# EAGLE design PCB-DISPLAYDOGM1 (EAGLE 7.7.0)

## Sheet 1 of 2
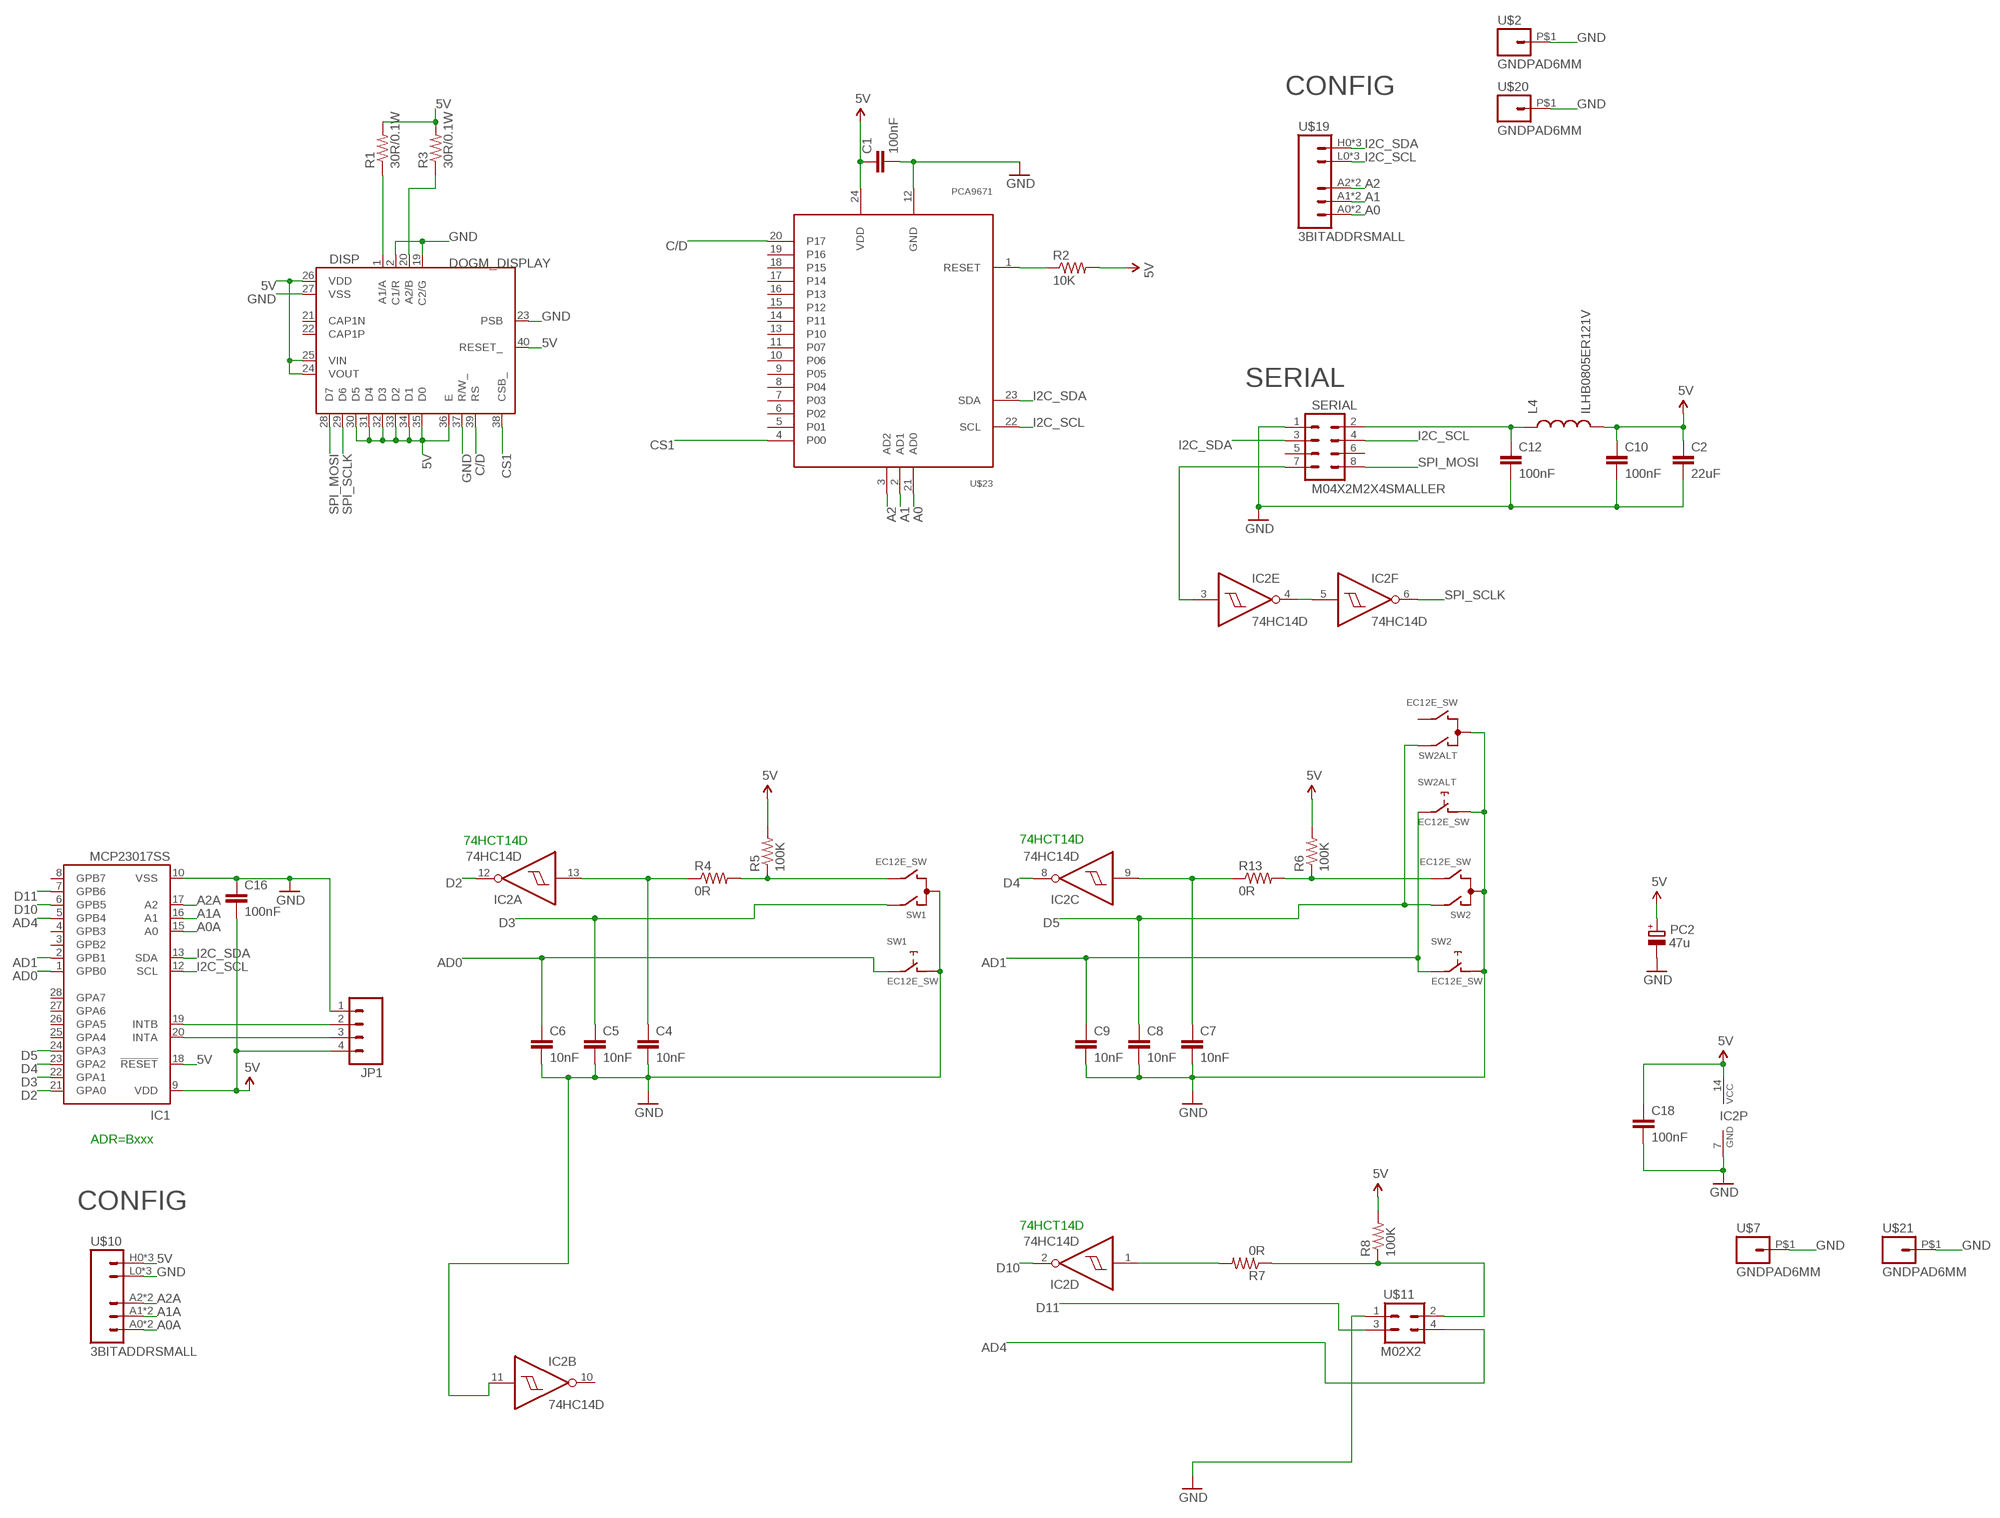
[diagram p0: schematic, sheet 1]

### Parts
C1  100nF  CAP0603-CAP  [0603-CAP]
C2  22uF  CAP0805  [0805]
C4  10nF  CAP0603-CAP  [0603-CAP]
C5  10nF  CAP0603-CAP  [0603-CAP]
C6  10nF  CAP0603-CAP  [0603-CAP]
C7  10nF  CAP0603-CAP  [0603-CAP]
C8  10nF  CAP0603-CAP  [0603-CAP]
C9  10nF  CAP0603-CAP  [0603-CAP]
C10  100nF  CAP0603-CAP  [0603-CAP]
C12  100nF  CAP0603-CAP  [0603-CAP]
C16  100nF  CAP0603-CAP  [0603-CAP]
C18  100nF  CAP0603-CAP  [0603-CAP]
DISP  DOGM_DISPLAY  [DOGM]
IC1  MCP23017SS  [SSOP28]
IC2  74HC14D  [SO14]
JP1  M04PTH  [1X04]
L4  ILHB0805ER121V  INDUCTOR0805  [0805]
PC2  47u  CPOL-EUD  [PANASONIC_D]
R1  30R/0.1W  RESISTOR0603-RES  [0603-RES]
R2  10K  RESISTOR0603-RES  [0603-RES]
R3  30R/0.1W  RESISTOR0603-RES  [0603-RES]
R4  0R  RESISTOR0603-RES  [0603-RES]
R5  100K  RESISTOR0603-RES  [0603-RES]
R6  100K  RESISTOR0603-RES  [0603-RES]
R7  0R  RESISTOR0603-RES  [0603-RES]
R8  100K  RESISTOR0603-RES  [0603-RES]
R13  0R  RESISTOR0603-RES  [0603-RES]
SERIAL  M04X2M2X4SMALLER  [M2X4SMALLER]
SW1  EC12E_SW  [ALPS_EC12E_SW]
SW2  EC12E_SW  [ALPS_EC12E_SW]
SW2ALT  EC12E_SW  [ALPS_EC12E_SW]
U$2  GNDPAD6MM  [3.2MMPAD6MM]
U$7  GNDPAD6MM  [3.2MMPAD6MM]
U$10  3BITADDRSMALL  [3BITADDR_SMALL]
U$11  M02X2  [2X2]
U$19  3BITADDRSMALL  [3BITADDR_SMALL]
U$20  GNDPAD6MM  [3.2MMPAD6MM]
U$21  GNDPAD6MM  [3.2MMPAD6MM]
U$23  PCA9671  [TSSOP24]

### Nets
5V [Power]: C1.1 C2.1 C10.1 C16.2 C18.1 DISP.24(VOUT) DISP.25(VIN) DISP.26(VDD) DISP.30(D5) DISP.31(D4) DISP.32(D3) DISP.33(D2) DISP.34(D1) DISP.35(D0) DISP.36(E) DISP.40(RESET_) IC1.9(VDD) IC1.18(!RESET) IC2.14(P:VCC) JP1.4 L4.2 PC2.+ R1.2 R2.2 R3.2 R5.2 R6.2 R8.2 U$10.H0(VCC) U$10.H1(VCC) U$10.H2(VCC) U$23.24(VDD)
A0: U$19.A0 U$19.AS0(A0) U$23.21(AD0)
A0A: IC1.15(A0) U$10.A0 U$10.AS0(A0)
A1: U$19.A1 U$19.AS1(A1) U$23.2(AD1)
A1A: IC1.16(A1) U$10.A1 U$10.AS1(A1)
A2: U$19.A2 U$19.AS2(A2) U$23.3(AD2)
A2A: IC1.17(A2) U$10.A2 U$10.AS2(A2)
AD0: C6.1 IC1.1(GPB0) SW1.E
AD1: C9.1 IC1.2(GPB1) SW2.E SW2ALT.E
AD4: IC1.5(GPB4) U$11.4
ARD_5V [Power]: C12.1 L4.1 SERIAL.2
C/D: DISP.39(RS) U$23.20(P17)
CS1: DISP.38(CSB_) U$23.4(P00)
D2: IC1.21(GPA0) IC2.12(A:O)
D3: C5.1 IC1.22(GPA1) SW1.A
D4: IC1.23(GPA2) IC2.8(C:O)
D5: C8.1 IC1.24(GPA3) SW2.A SW2ALT.A
D10: IC1.6(GPB5) IC2.2(D:O)
D11: IC1.7(GPB6) U$11.3
GND [Power]: C1.2 C2.2 C4.2 C5.2 C6.2 C7.2 C8.2 C9.2 C10.2 C12.2 C16.1 C18.2 DISP.2(C1/R) DISP.19(C2/G) DISP.23(PSB) DISP.27(VSS) DISP.37(R/W_) IC1.10(VSS) IC2.7(P:GND) IC2.11(B:I) JP1.1 PC2.- SERIAL.1 SW1.C SW1.D SW2.C SW2.D SW2ALT.C SW2ALT.D U$2.P$1 U$7.P$1 U$10.L0(GND) U$10.L1(GND) U$10.L2(GND) U$11.1 U$20.P$1 U$21.P$1 U$23.12(GND)
I2C_SCL: IC1.12(SCL) SERIAL.4 U$19.L0(GND) U$19.L1(GND) U$19.L2(GND) U$23.22(SCL)
I2C_SDA: IC1.13(SDA) SERIAL.3 U$19.H0(VCC) U$19.H1(VCC) U$19.H2(VCC) U$23.23(SDA)
N$1: R2.1 U$23.1(RESET)
N$2: DISP.1(A1/A) R1.1
N$3: DISP.20(A2/B) R3.1
N$4: R4.2 R5.1 SW1.B
N$5: IC2.1(D:I) R7.2
N$6: R6.1 R13.2 SW2.B
N$7: IC2.4(E:O) IC2.5(F:I)
N$8: IC2.3(E:I) SERIAL.7
N$17: IC1.19(INTB) JP1.2
N$18: IC1.20(INTA) JP1.3
N$124: C4.1 IC2.13(A:I) R4.1
N$125: C7.1 IC2.9(C:I) R13.1
N$127: R7.1 R8.1 U$11.2
SPI_MOSI: DISP.28(D7) SERIAL.8
SPI_SCLK: DISP.29(D6) IC2.6(F:O)
Unconnected: DISP.21(CAP1N) DISP.22(CAP1P) IC1.3(GPB2) IC1.4(GPB3) IC1.8(GPB7) IC1.25(GPA4) IC1.26(GPA5) IC1.27(GPA6) IC1.28(GPA7) IC2.10(B:O) SERIAL.5 SERIAL.6 SW1.GND1(G) SW1.GND2(G) SW2.GND1(G) SW2.GND2(G) SW2ALT.B SW2ALT.GND1(G) SW2ALT.GND2(G) U$23.5(P01) U$23.6(P02) U$23.7(P03) U$23.8(P04) U$23.9(P05) U$23.10(P06) U$23.11(P07) U$23.13(P10) U$23.14(P11) U$23.15(P12) U$23.16(P13) U$23.17(P14) U$23.18(P15) U$23.19(P16)

### Notes on the sheet
- CONFIG
- SERIAL
- 74HCT14D | 74HCT14D
- ADR=Bxxx
- CONFIG
- 74HCT14D

## Sheet 2 of 2

## Library data of the parts
C1 C2 C4-C10 C12 C16 C18 = SparkFun:CAP: Capacitor Standard 0603 ceramic capacitor, and 0.1" leaded capacitor.
DISP = SKAARHOJ:DOGM_DISPLAY
IC1 = microchip:MCP23017: http://ww1.microchip.com/downloads/en/DeviceDoc/21952a.pdf Source: http://ww1.microchip.com/downloads/en/DeviceDoc/21952a.pdf; MF: MICROCHIP; MPN: MCP23017-E/SS; OC_FARNELL: 1467674; OC_NEWARK: 31K2960
IC2 = 74xx-eu:74*14: Hex schmitt trigger INVERTER
JP1 = SparkFun:M04: Header 4 Standard 4-pin 0.1" header. Use with straight break away headers (SKU : PRT-00116), right angle break away headers (PRT-00553), swiss pins (PRT-00743), machine pins (PRT-00117), and female headers (PRT-00115). Molex polarized connector foot print use with SKU : PRT-08231 with associated crimp pins and housings. 1MM SMD Version SKU: PRT-10208
L4 = SparkFun:INDUCTOR: Inductors Basic Inductor/Choke - 0603 and 1206. Footprints are not proven and vary greatly between part numbers.
PC2 = rcl:CPOL-EU: POLARIZED CAPACITOR, European symbol
R1-R8 R13 = SparkFun:RESISTOR: Resistor Basic schematic elements and footprints for 0603, 1206, and PTH resistors.
SERIAL = SKAARHOJ:M04X2
SW1 SW2 SW2ALT = switch-alps:EC12E_SW: ALPS rotary Encoder EC12E series with switch; MPN: EC12E2424407; OC_FARNELL: 1520813; OC_NEWARK: 74M1068
U$2 U$7 U$20 U$21 = SKAARHOJ:GNDPAD
U$10 U$19 = SKAARHOJ:3BITADDR
U$11 = SKAARHOJ:M02X2
U$23 = SKAARHOJ:PCA9671

## Net classes
0 default: width 0.203 mm, drill 0.406 mm, clearance 0.203 mm
1 Power: width 0.406 mm, drill 0.61 mm, clearance 0.203 mm
2 BoostPower: width 0.61 mm, drill 0.61 mm, clearance 0.305 mm

## Board
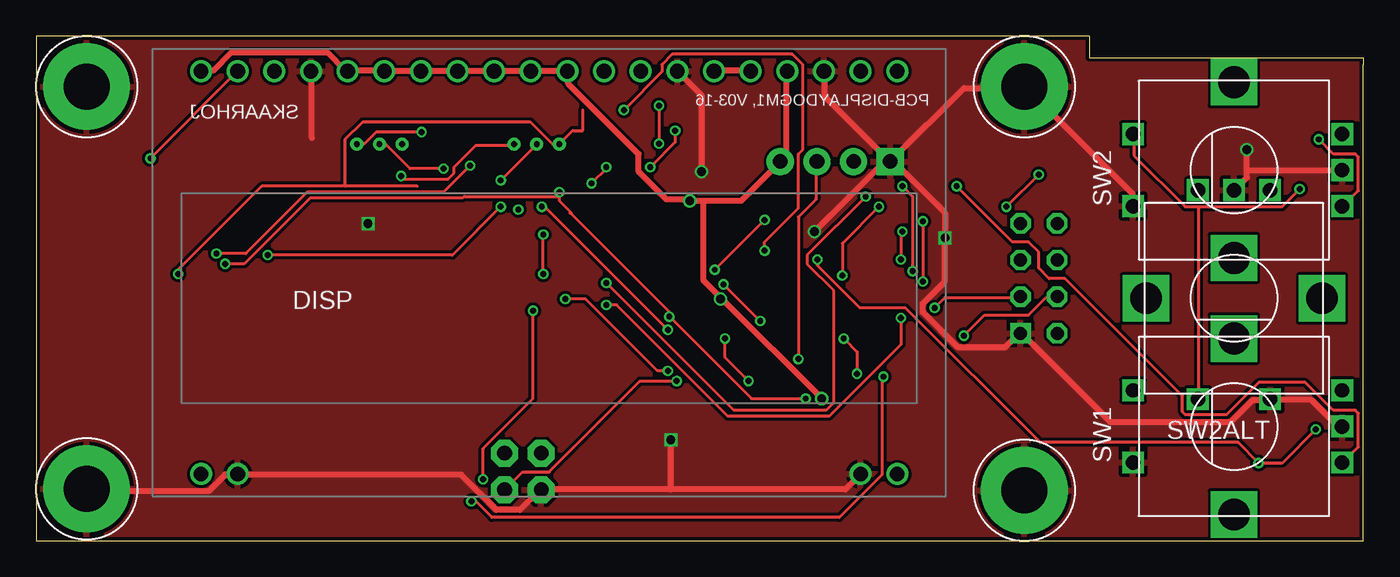
[diagram p1: board, top side]
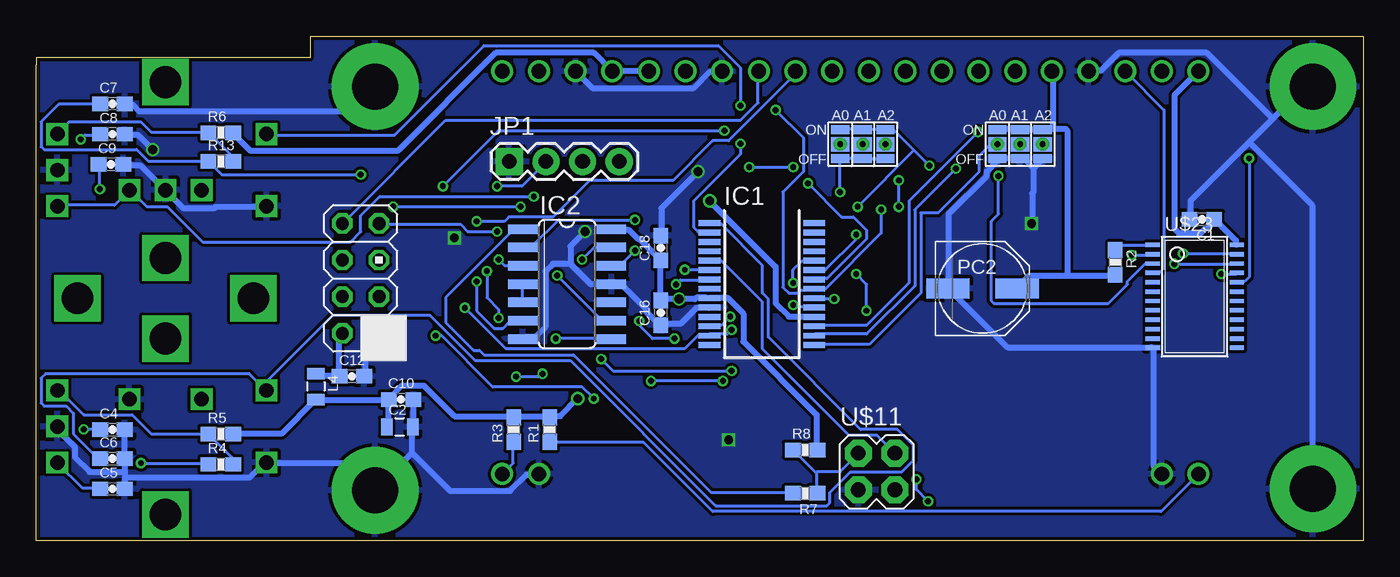
[diagram p2: board, bottom side, seen from below]

Size 92 x 35 mm. Coordinates in mm from the lower left corner, seen from the top.
Outline: 92,0 92,33 92,33.5 73,33.5 73,35 0,35 0,0 92,0
Copper layers (1*16): Top 0.035mm / dielectric 1.5mm / Bottom 0.035mm
Design rules "Fusion_eagle_rule_v1.1": minimum track width 6mil, minimum drill 12mil, track to track 6mil, track to pad 6mil, pad to pad 6mil, via to via 6mil, smd to smd 0mil, copper to edge 10mil, drill to drill 10mil, minimum pad ring 10mil, minimum via ring 6mil, stop-mask expansion 2mil, vias tented up to drill 100mil, thermal gap 10mil

### Footprints (pad centres in the part's own frame; a part is rotated, then mirrored left to right if it is on the bottom)
0603-CAP = smd 1.1 x 1: 1 -0.85,0; 2 0.85,0
0805 = smd 0.8 x 1.2: 1 -0.9,0; 2 0.9,0
DOGM = drill 1.016: 1 -24.13,-12.19; 2 -21.59,-12.19; 19 21.59,-12.19; 20 24.13,-12.19; 21 24.13,15.75; 22 21.59,15.75; 23 19.05,15.75; 24 16.51,15.75; 25 13.97,15.75; 26 11.43,15.75; 27 8.89,15.75; 28 6.35,15.75; 29 3.81,15.75; 30 1.27,15.75; 31 -1.27,15.75; 32 -3.81,15.75; 33 -6.35,15.75; 34 -8.89,15.75; 35 -11.43,15.75; 36 -13.97,15.75; 37 -16.51,15.75; 38 -19.05,15.75; 39 -21.59,15.75; 40 -24.13,15.75
SSOP28 = smd 0.4 x 1.5: 1 -4.225,-3.625; 2 -3.575,-3.625; 3 -2.925,-3.625; 4 -2.275,-3.625; 5 -1.625,-3.625; 6 -0.975,-3.625; 7 -0.325,-3.625; 8 0.325,-3.625; 9 0.975,-3.625; 10 1.625,-3.625; 11 2.275,-3.625; 12 2.925,-3.625; 13 3.575,-3.625; 14 4.225,-3.625; 15 4.225,3.625; 16 3.575,3.625; 17 2.925,3.625; 18 2.275,3.625; 19 1.625,3.625; 20 0.975,3.625; 21 0.325,3.625; 22 -0.325,3.625; 23 -0.975,3.625; 24 -1.625,3.625; 25 -2.275,3.625; 26 -2.925,3.625; 27 -3.575,3.625; 28 -4.225,3.625
SO14 = smd 0.66 x 2.032: 1 -3.81,-3.073; 2 -2.54,-3.073; 3 -1.27,-3.073; 4 0,-3.073; 5 1.27,-3.073; 6 2.54,-3.073; 7 3.81,-3.073; 8 3.81,3.073; 9 2.54,3.073; 10 1.27,3.073; 11 0,3.073; 12 -1.27,3.073; 13 -2.54,3.073; 14 -3.81,3.073
1X04 = drill 1.016 pad 1.88 square: 1 0,0 | drill 1.016 pad 1.88: 2 2.54,0; 3 5.08,0; 4 7.62,0
PANASONIC_D = smd 3 x 1.4: + 2.4,0; - -2.4,0
0603-RES = smd 1.1 x 1: 1 -0.85,0; 2 0.85,0
M2X4SMALLER = drill 0.9 square: 1 -1.27,3.81 | drill 0.9 octagon: 2 1.27,3.81; 3 -1.27,1.27; 4 1.27,1.27; 5 -1.27,-1.27; 6 1.27,-1.27; 7 -1.27,-3.81; 8 1.27,-3.81
ALPS_EC12E_SW = drill 1 square: A -2.5,-7.5; B 2.5,-7.5; C 0,-7.5; D -2.5,7; E 2.5,7 | drill 2.2 square: GND1 -6.1,0; GND2 6.1,0
3.2MMPAD6MM = drill 3.2 pad 6: P$1 0,0
3BITADDR_SMALL = drill 0.4: A0 -1.565,0; A1 0,0; A2 1.565,0 | smd 1.27 x 1: AS0 -1.565,0; AS1 0,0; AS2 1.565,0 | smd 1.27 x 0.635: H0 -1.565,1; H1 0,1; H2 1.565,1; L0 -1.565,-1; L1 0,-1; L2 1.565,-1
2X2 = drill 1.016 pad 1.88 octagon: 1 -3.81,-1.27; 2 -3.81,1.27; 3 -1.27,-1.27; 4 -1.27,1.27
TSSOP24 = smd 0.305 x 0.991: 1 -4.225,-2.918; 2 -3.575,-2.918; 3 -2.925,-2.918; 4 -2.275,-2.918; 5 -1.625,-2.918; 6 -0.975,-2.918; 7 -0.325,-2.918; 8 0.325,-2.918; 9 0.975,-2.918; 10 1.625,-2.918; 11 2.275,-2.918; 12 2.925,-2.918; 13 2.925,2.918; 14 2.275,2.918; 15 1.625,2.918; 16 0.975,2.918; 17 0.325,2.918; 18 -0.325,2.918; 19 -0.975,2.918; 20 -1.625,2.918; 21 -2.275,2.918; 22 -2.925,2.918; 23 -3.575,2.918; 24 -4.225,2.918

### Placement (x,y rotation side)
C1  11.2,22.3 180 bottom
C2  66.8,7.9 0 bottom
C4  86.7,7.7 0 bottom
C5  86.7,3.6 0 bottom
C6  86.7,5.7 0 bottom
C7  86.7,30.3 0 bottom
C8  86.7,28.2 0 bottom
C9  86.8,26.1 0 bottom
C10  66.7,9.8 0 bottom
C12  70.1,11.4 0 bottom
C16  48.7,15.8 90 bottom
C18  48.7,20.3 90 bottom
DISP  35.56,16.81 0 top
IC1  41.7,17.8 270 bottom
IC2  55.2,17.8 270 bottom
JP1  59.2,26.3 0 bottom
L4  72.6,10.7 270 bottom
PC2  26.4,17.5 0 bottom
R1  56.4,7.7 90 bottom
R2  17.2,19.3 270 bottom
R3  58.9,7.7 90 bottom
R4  79.2,5.3 0 bottom
R5  79.2,7.4 0 bottom
R6  79.2,28.3 0 bottom
R7  38.7,3.3 180 bottom
R8  38.7,6.3 0 bottom
R13  79.2,26.3 0 bottom
SERIAL  69.5,18.2 180 bottom
SW1  83.03,7.92 90 top
SW2  83.03,25.7 90 top
SW2ALT  83.03,16.81 180 top
U$2  3.5,31.5 0 top
U$7  68.5,3.5 0 top
U$10  23.8,27.5 0 bottom
U$11  31.2,4.8 0 bottom
U$19  34.7,27.5 0 bottom
U$20  68.5,31.5 0 top
U$21  3.5,3.6 0 top
U$23  11.7,16.3 270 bottom

### Tracks (layer width: path | path; a pad name or v marks a point on that pad's centre or on a via)
5V  (via drill 0.61)
  Top 0.406: DISP.36 21.64,32.61 24.08,32.61 DISP.35 24.28,32.61 26.62,32.61 DISP.34 26.82,32.61 29.16,32.61 DISP.33 29.36,32.61 31.7,32.61 DISP.32 31.9,32.61 34.24,32.61 DISP.31 34.44,32.61 36.78,32.61 DISP.30 36.88,32.41 36.88,31.7 41.76,26.82 41.76,25.6 43.69,23.67 45.21,23.67 v45.31,23.57 46.23,23.57 | 21.64,32.41 DISP.36 | DISP.40 11.48,32.61 12.29,32.61 13.51,33.83 20.22,33.83 21.44,32.61 DISP.36 | DISP.26 47.04,32.61 49.48,32.61 DISP.25 | 46.23,23.57 48.87,23.57 51.51,26.21 JP1.4 51.71,26.42 52.02,26.72 52.02,32.51 DISP.24 | 47.5,16.82 46.23,18.09 46.23,23.57 | 47.5,16.82 v54.46,9.86 | v47.45,16.76 47.5,16.82
  Bottom 0.406: U$23.24 8.84,20.62 8.84,20.83 10.26,22.25 C1.1 10.46,22.15 11.28,21.34 12.8,21.34 13.11,21.64 13.11,30.89 11.48,32.51 DISP.40 | 20.52,18.39 23.16,18.39 23.98,17.58 PC2.+ | 20.52,18.39 17.27,18.39 R2.2 | 20.52,18.39 20.52,28.45 20.62,28.55 21.54,28.55 | R6.2 78.33,28.25 77.11,27.03 66.95,27.03 60.15,33.83 53.34,33.83 52.12,32.61 DISP.24 51.92,32.61 49.58,32.61 DISP.25 | IC2.14 52.12,21.54 50.9,21.54 50.29,20.93 50.19,20.93 48.77,19.51 C18.1 48.77,19.41 48.77,16.66 C16.2 48.56,16.76 v47.45,16.76 46.33,16.76 46.23,16.87 45.52,16.87 IC1.9 45.31,16.87 44.09,16.87 42.98,15.75 42.98,13.82 37.9,8.74 37.9,6.4 R8.2 | C10.1 67.56,9.75 67.56,8.03 67.67,7.92 C2.1 | R5.2 78.33,7.42 74.98,7.42 72.64,9.75 L4.2 72.44,9.75 67.77,9.75 C10.1 | C10.1 67.46,9.96 66.65,10.77 65.13,10.77 62.99,8.64 59.03,8.64 R3.2 58.83,8.64 56.49,8.64 R1.2 56.29,8.64 55.68,8.64 v54.46,9.86 | v45.31,23.57 40.74,19 40.74,16.46 39.83,15.54 38.1,15.54 IC1.18 | U$10.H0 25.3,28.55 23.98,28.55 U$10.H1 23.77,28.55 22.25,28.55 U$10.H2 22.05,28.55 21.54,28.55 | 21.54,28.55 21.54,32.51 DISP.36
A0  (via drill 0.41)
  Top 0.203: v9.86,18.49 9.86,18.8 15.65,24.59 21.44,24.59 | 26.42,24.59 21.44,24.59 | 37.9,29.87 37.9,28.45 37.19,28.45 36.27,27.53 U$19.AS0 36.17,27.53 35.76,27.53 34.24,29.06 22.66,29.06 21.44,27.84 21.44,24.59
  Bottom 0.203: v9.86,18.49 8.84,18.49 U$23.21 | 36.27,27.53 U$19.AS0
A0A
  Bottom 0.203: IC1.15 38,13.61 34.24,13.61 30.68,17.17 30.68,22.76 29.46,22.76 26.62,25.6 26.62,26.72 25.81,27.53 25.5,27.53 U$10.AS0 25.4,27.53
A1  (via drill 0.41)
  Top 0.203: v16.05,19.81 28.85,19.81 v32.21,23.16 | v32.21,24.99 34.65,27.43 U$19.AS1
  Bottom 0.203: v16.05,19.81 14.63,19.81 U$23.2 | 34.75,27.53 U$19.AS1 | v32.21,23.16 v32.21,24.99
A1A  (via drill 0.41)
  Top 0.203: v28.25,25.81 25.91,25.81 24.28,27.43 23.88,27.43 U$10.AS1
  Bottom 0.203: IC1.16 38,14.33 34.44,14.33 31.09,17.68 31.09,22.96 v28.25,25.81 | 23.88,27.53 U$10.AS1
A2  (via drill 0.41)
  Top 0.203: v25.3,25.3 25.5,25.09 28.55,25.09 28.96,25.5 28.96,25.91 30.48,27.43 33.12,27.43 U$19.AS2
  Bottom 0.203: U$23.3 14.63,19.2 15.14,19.2 16.36,17.98 16.36,17.78 17.68,16.46 25.6,16.46 25.81,16.66 25.81,22.15 25.3,22.66 v25.3,25.3 | 33.12,27.53 U$19.AS2
A2A  (via drill 0.41)
  Top 0.203: v26.72,28.35 23.57,28.35 22.76,27.53 22.25,27.53 U$10.AS2
  Bottom 0.203: IC1.17 38,14.94 34.44,14.94 31.5,17.88 31.5,23.57 v26.72,28.35 | 22.25,27.53 U$10.AS2
AD0
  Bottom 0.203: C6.1 87.58,5.79 87.78,5.79 89.41,7.42 89.41,8.84 89.92,9.35 91.44,9.35 91.64,9.55 91.64,11.28 91.34,11.58 77.22,11.58 76.1,10.46 SW1.E 76.3,10.77 71.42,15.65 64.72,15.65 61.57,12.5 54.97,12.5 44.91,2.44 37.19,2.44 36.98,2.64 36.98,3.35 35.56,4.78 32,4.78 31.19,5.59 31.19,6.6 32.31,7.72 34.85,7.72 41.25,14.12 41.25,16.76 41.66,17.17 41.66,19.1 44.5,21.95 45.31,21.95 IC1.1
AD1  (via drill 0.41)
  Top 0.203: v87.58,24.38 86.36,23.16 80.57,23.16 | 80.57,23.16 79.65,23.16 76.1,26.72 76.1,28.14 SW2.E | v43.18,30.18 v43.18,27.53 | 80.57,23.16 80.57,9.86 SW2ALT.E
  Bottom 0.203: v87.58,24.38 87.58,26.01 C9.1 | v43.18,27.53 43.18,26.82 46.43,23.57 46.43,21.74 46.13,21.44 45.41,21.44 IC1.2 | v43.18,30.18 43.18,32.82 44.7,34.34 60.96,34.34 67.16,28.14 76,28.14 SW2.E
AD4
  Bottom 0.203: IC1.5 45.31,19.41 44.5,19.41 41.66,16.56 41.66,13.31 35.66,7.32 33.73,7.32 32.51,6.1 U$11.4
ARD_5V
  Bottom 0.406: L4.1 72.54,11.58 72.44,11.48 71.02,11.48 C12.1 71.02,11.68 71.02,14.12 70.81,14.33 SERIAL.2
C/D  (via drill 0.41)
  Top 0.203: v7.92,26.52 13.92,32.51 DISP.39
  Bottom 0.203: v7.92,26.52 7.92,18.29 8.23,17.98 8.74,17.98 U$23.20
CS1
  Bottom 0.203: U$23.4 14.53,18.59 14.12,18.59 13.82,18.9 13.82,29.87 16.46,32.51 DISP.38
D2  (via drill 0.41)
  Top 0.203: v40.74,29.87 43.38,32.51 43.38,33.02 44.09,33.73 52.43,33.73 53.14,33.02 53.14,27.13 52.83,26.82 52.83,23.06 50.49,20.73 v50.49,20.12
  Bottom 0.203: v33.43,22.96 33.43,21.34 37.29,17.48 38,17.48 IC1.21 38.1,17.37 39.01,17.37 39.22,17.17 39.83,17.17 40.23,17.58 40.23,24.18 38.81,25.6 38.81,27.94 v40.74,29.87 | v50.49,20.12 51.51,19.1 52.12,19.1 IC2.12
D3  (via drill 0.41)
  Top 0.203: v38.51,24.79 39.52,25.81 v39.52,25.91 | v42.57,25.91 44.3,27.64 v44.3,28.45 | v63.8,24.59 67.67,20.73 68.78,20.73 69.49,20.02 69.49,18.9 70.21,18.19 71.32,18.19 79.45,10.06 79.45,8.94 79.65,8.74 82.5,8.74 84.73,10.97 87.99,10.97 89.92,9.04 91.44,9.04 91.64,8.84 91.64,6.5 90.63,5.49 SW1.A
  Bottom 0.203: C5.1 87.58,3.66 88.8,3.66 90.53,5.38 SW1.A | v38.51,24.79 36.17,22.45 35.36,22.45 34.44,21.54 34.44,20.93 37.19,18.19 38,18.19 IC1.22 | v42.57,25.91 v39.52,25.91 | v44.3,28.45 59.94,28.45 v63.8,24.59
D4  (via drill 0.41)
  Top 0.203: v35.15,18.49 v35.15,21.23 | v34.44,15.95 34.44,9.86 30.99,6.4 v30.99,4.27 | v30.18,2.74 30.48,2.74 31.6,1.63 55.68,1.63 58.62,4.57 58.62,11.28 v58.73,11.38 | v56.9,11.58 56.9,13.11 v55.98,14.02
  Bottom 0.203: v35.15,21.23 35.15,20.93 37.29,18.8 38,18.8 IC1.23 | v35.15,18.49 34.44,17.78 v34.44,15.95 | v30.99,4.27 30.99,3.56 v30.18,2.74 | v58.73,11.38 57.1,11.38 v56.9,11.58 | v55.98,14.02 52.22,14.02 IC2.8
D5  (via drill 0.41)
  Top 0.203: v88.9,27.84 89.92,26.82 91.44,26.82 91.64,26.62 91.64,24.28 90.63,23.27 SW2.A | v39.52,17.88 48.36,9.04 54.76,9.04 55.27,9.55 55.27,17.37 53.44,19.2 53.44,19.81 v57.51,23.88
  Bottom 0.203: v88.9,27.84 88.59,28.14 87.58,28.14 C8.1 | v39.52,17.88 39.52,18.8 38.91,19.41 38.1,19.41 IC1.24 | v57.51,23.88 68.17,23.88 69.49,22.55 69.49,21.44 70.21,20.73 80.47,20.73 82.91,23.16 84.33,23.16 85.45,24.28 SW2ALT.A 85.55,24.28 86.56,23.27 90.53,23.27 SW2.A
D10  (via drill 0.41)
  Top 0.203: v50.49,22.25 v47.04,18.8
  Bottom 0.203: v47.04,18.8 45.41,18.8 IC1.6 | v50.49,22.25 55.78,22.25 57.61,20.42 58.22,20.42 IC2.2
D11  (via drill 0.41)
  Top 0.203: v50.19,15.24 v47.65,17.78 | v47.75,14.02 47.75,12.7 v49.38,11.07 | v44.4,11.07 41.86,11.07 35.56,4.78 33.73,4.78 32.51,3.56 U$11.3
  Bottom 0.203: v47.65,17.78 47.35,18.09 45.41,18.09 IC1.7 | v50.19,15.24 50.19,14.94 49.28,14.02 v47.75,14.02 | v44.4,11.07 v49.38,11.07
GND  (via drill 0.6, 0.61)
  Top 0.406: U$21.P$1 3.56,3.56 3.66,3.45 11.99,3.45 13.11,4.57 13.92,4.57 DISP.2 14.12,4.57 29.46,4.57 31.9,2.13 33.53,2.13 34.85,3.45 U$11.1 35.05,3.56 43.99,3.56 | 19.1,27.94 19.1,32.51 DISP.37 | SW1.C 90.22,7.92 88.39,9.75 85.55,9.75 SW2ALT.D 85.34,9.75 84.33,9.75 82.8,8.23 74.47,8.23 68.38,14.33 SERIAL.1 68.07,14.33 67.16,13.41 63.91,13.41 61.47,15.85 61.47,16.46 62.99,17.98 62.99,20.83 v63,21 62.99,21.03 62.99,22.76 59.44,26.31 JP1.1 | 43.99,3.56 56.08,3.56 57.1,4.57 DISP.19 | 83.92,25.7 83.92,25.2 83.11,24.38 SW2ALT.C | 83.92,25.7 v83.92,27.13 | 83.92,25.7 SW2.C | SW2.D 76,23.27 76,24.08 68.58,31.5 U$20.P$1 68.38,31.39 64.31,31.39 59.33,26.42 JP1.1 | v46.13,25.6 46.13,30.89 44.5,32.51 DISP.27 | DISP.23 54.66,32.51 54.66,30.79 59.13,26.31 JP1.1 | 43.99,3.56 43.99,6.91 v44,7 | v53.95,21.44 58.93,26.42 JP1.1
  Bottom 0.406: DISP.2 14.02,4.67 14.53,5.18 14.53,13.31 U$23.12 14.73,13.41 24.69,13.41 28.65,17.37 PC2.- 28.75,17.58 28.75,22.66 26.11,25.3 26.11,25.6 25.4,26.31 U$10.L0 25.3,26.52 23.98,26.52 U$10.L1 23.77,26.42 23.47,26.42 22.86,25.81 | 6.3,29.26 4.06,31.5 3.56,31.5 U$2.P$1 | 6.3,29.26 7.92,27.64 | 7.92,27.64 11.99,23.57 11.99,22.35 C1.2 | 6.3,29.26 10.87,33.83 16.97,33.83 18.19,32.61 19,32.61 DISP.37 | 85.85,4.78 C6.2 85.85,5.89 85.85,7.62 C4.2 | 85.85,4.78 85.85,4.37 | 85.85,4.37 85.85,3.66 C5.2 | 85.85,4.78 88.29,4.78 89.31,5.79 89.31,6.5 90.53,7.72 SW1.C | C10.2 65.84,9.75 65.84,7.92 C2.2 65.94,7.72 65.94,6.1 | 65.94,6.1 68.48,3.56 U$7.P$1 68.68,3.56 70.51,5.38 76,5.38 SW1.D 76.2,5.38 77.22,4.37 85.85,4.37 | 65.94,6.1 63.3,3.45 59.13,3.45 58.01,4.57 57.2,4.57 DISP.19 | v83.92,27.13 84.94,28.14 85.75,28.14 C8.2 | C9.2 85.85,26.01 84.73,26.01 83.11,24.38 SW2ALT.C 82.91,24.18 81.79,23.06 79.65,23.06 79.55,23.16 76.1,23.16 SW2.D | C7.2 85.75,30.28 85.34,30.28 84.84,29.77 70.31,29.77 68.58,31.5 U$20.P$1 | 58.32,14.02 IC2.7 58.12,14.12 57.4,14.12 56.69,14.83 56.69,18.69 56.19,19.2 54.97,19.2 | IC1.10 45.41,16.15 46.23,16.15 47.35,15.04 48.67,15.04 C16.1 48.87,15.04 49.68,15.85 49.68,16.05 51.41,17.78 52.12,17.78 IC2.11 52.32,17.78 53.54,17.78 54.97,19.2 | v46.13,25.6 48.67,23.06 48.67,21.23 C18.2 | C12.2 69.19,11.48 69.19,13.41 68.28,14.33 SERIAL.1 | DISP.27 44.5,32.51 45.31,32.51 46.43,31.39 53.44,31.39 54.56,32.51 DISP.23 | v23,22 22.96,22.05 22.96,24.08 22.86,24.18 22.86,25.81 | 54.97,19.2 54.97,20.42 v53.95,21.44 | 22.86,25.81 22.25,26.42 U$10.L2 | 7.92,27.64 3.56,23.27 3.56,3.66 U$21.P$1
  pour Top: 0,0 92,0 92,35 0,35
  pour Bottom: 0,0 92,0 92,35 0,35
I2C_SCL  (via drill 0.41)
  Top 0.203: v13.11,19.2 14.43,19.2 19,23.77 29.57,23.77 29.67,23.88 36.27,23.88 | 36.98,22.76 37.03,22.71 | 37.03,22.71 43.89,15.85 v43.89,15.54 49.58,9.86 v53.34,9.86 | v64.31,14.22 65.73,15.65 68.78,15.65 70,16.87 70.71,16.87 SERIAL.4 | 36.27,23.88 36.27,23.57 37.08,22.76 37.03,22.71 | 36.27,23.88 v36.27,24.18
  Bottom 0.203: v13.11,19.2 8.84,19.2 U$23.22 | v43.89,15.54 44.5,14.94 45.31,14.94 IC1.12 | v64.31,14.22 63.91,14.22 60.35,10.67 54.15,10.67 v53.34,9.86 | U$19.L2 33.22,26.52 34.65,26.52 U$19.L1 34.75,26.52 36.17,26.52 U$19.L0 36.27,26.42 v36.27,24.18
I2C_SDA  (via drill 0.41)
  Top 0.203: v12.5,19.91 14.53,19.91 18.8,24.18 28.25,24.18 v30.07,26.01 | v43.79,14.63 35.26,23.16 v35.05,23.16 | v62.28,16.15 62.99,16.87 68.17,16.87 SERIAL.3
  Bottom 0.203: v12.5,19.91 8.84,19.91 U$23.23 | v43.79,14.63 44.09,14.33 45.31,14.33 IC1.13 45.41,14.22 46.13,14.22 47.04,13.31 59.44,13.31 v62.28,16.15 | U$19.H0 36.17,28.55 34.75,28.55 U$19.H1 34.65,28.55 33.22,28.55 U$19.H2 33.12,28.45 32.51,28.45 31.14,27.08 | v30.07,26.01 31.14,27.08 | v35.05,23.16 31.14,27.08
N$1
  Bottom 0.203: U$23.1 16.87,20.52 17.17,20.22 R2.1
N$2
  Bottom 0.203: R1.1 56.39,6.81 49.89,6.81 45.11,2.03 14.02,2.03 11.48,4.57 DISP.1
N$3
  Bottom 0.203: R3.1 58.93,6.81 58.93,5.38 59.64,4.67 DISP.20
N$4
  Bottom 0.203: R4.2 78.44,5.38 78.44,5.79 79.96,7.32 R5.1 80.06,7.42 84.02,7.42 85.34,8.74 88.7,8.74 90.32,10.36 90.53,10.36 SW1.B
N$5
  Bottom 0.203: R7.2 39.62,3.35 45.21,3.35 54.76,12.9 60.96,12.9 61.27,13.21 61.67,13.21 63.6,15.14 63.6,16.87 58.93,21.54 58.32,21.54 IC2.1
N$6
  Bottom 0.203: R13.2 78.44,26.31 78.44,26.72 79.96,28.25 R6.1 80.06,28.35 84.02,28.35 84.73,29.06 89.71,29.06 90.53,28.25 SW2.B
N$7
  Bottom 0.203: IC2.5 58.32,16.56 58.32,17.78 IC2.4
N$8  (via drill 0.41)
  Top 0.203: v59.94,19.51 59.94,21.34 v60.05,21.44
  Bottom 0.203: v59.94,19.51 59.54,19.1 58.32,19.1 IC2.3 | v60.05,21.44 62.08,21.44 62.59,21.95 68.17,21.95 SERIAL.7
N$17  (via drill 0.41)
  Top 0.203: v39.52,16.36 40.23,16.36 47.95,8.64 54.97,8.64 59.94,13.61 v59.94,15.44 | v60.76,18.69 60.76,23.88 v60.05,24.59
  Bottom 0.203: v39.52,16.36 39.42,16.26 38.1,16.26 IC1.19 | v59.94,15.44 59.94,16.05 60.76,16.87 v60.76,18.69 | v60.05,24.59 58.32,24.59 56.69,26.21 JP1.2
N$18  (via drill 0.41)
  Top 0.203: v36.68,16.76 38.1,16.76 43.08,11.79 v43.79,11.79 | v52.83,12.6 52.83,22.45 54.05,23.67 54.05,26.21 JP1.3
  Bottom 0.203: v36.68,16.76 38,16.76 IC1.20 | v43.79,11.79 52.02,11.79 v52.83,12.6
N$124  (via drill 0.41)
  Top 0.203: v88.7,7.72 86.36,5.38 v84.73,5.38 83.31,6.81 69.6,6.81 60.25,16.15 57.1,16.15 54.15,19.1 v54.15,19.51
  Bottom 0.203: v84.73,5.38 80.06,5.38 R4.1 | v88.7,7.72 87.58,7.72 C4.1 | v54.15,19.51 53.34,20.32 52.22,20.32 IC2.13
N$125  (via drill 0.41)
  Top 0.203: v55.88,18.39 55.88,20.62 v58.42,23.16 | v69.49,25.4 v67.26,23.16
  Bottom 0.203: C7.1 87.58,30.28 90.42,30.28 91.64,29.06 91.64,27.33 91.44,27.13 85.04,27.13 84.23,26.31 80.06,26.31 R13.1 79.96,26.21 79.15,25.4 v69.49,25.4 | v55.88,18.39 52.83,15.34 52.22,15.34 IC2.9 | v67.26,23.16 v58.42,23.16
N$127
  Bottom 0.203: 37.95,4.72 39.52,6.3 R8.1 | 37.95,4.72 37.9,4.67 37.9,3.35 R7.1 | 37.95,4.72 37.9,4.78 36.27,4.78 35.05,5.99 U$11.2
SPI_MOSI
  Bottom 0.203: DISP.28 41.96,32.51 41.96,30.38 43.18,29.16 63.6,29.16 70.71,22.05 SERIAL.8
SPI_SCLK  (via drill 0.41)
  Top 0.203: v61.47,22.15 v61.47,17.98
  Bottom 0.203: v61.47,17.98 61.47,15.95 60.25,14.73 59.64,14.73 59.13,15.24 58.32,15.24 IC2.6 | v61.47,22.15 59.54,22.15 59.23,22.45 56.19,22.45 53.65,24.99 47.85,24.99 45.11,27.74 43.99,27.74 39.42,32.31 39.42,32.51 DISP.29

### Text on the board
_tsilk: PCB-DISPLAYDOGM1, V03-16 | SKAARHOJ